# EAGLE design untitled (EAGLE 7.7.0)
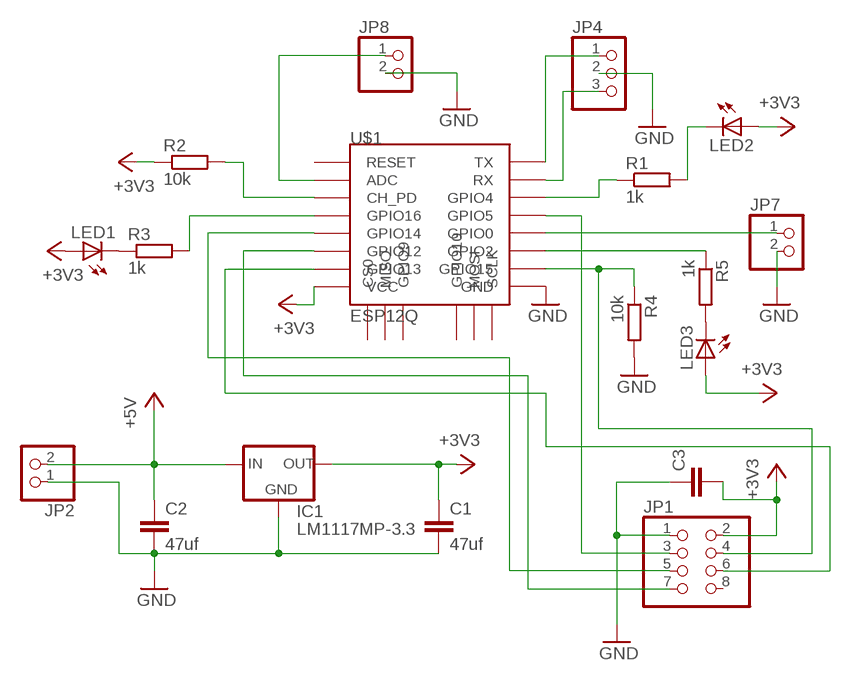
[diagram p0: schematic, sheet 1]

## Parts
C1  47uf  C-EUC1812K  [C1812K]
C2  47uf  C-EUC1812K  [C1812K]
C3  C-EUC3216  [C3216]
IC1  LM1117MP-3.3  [SOT223]
JP1  PINHD-2X4  [2X04]
JP2  PINHD-1X2  [1X02]
JP4  PINHD-1X3  [1X03]
JP7  PINHD-1X2  [1X02]
JP8  PINHD-1X2  [1X02]
LED1  LEDSFH482  [SFH482]
LED2  LEDSFH482  [SFH482]
LED3  LEDSFH482  [SFH482]
R1  1k  R-EU_R0805  [R0805]
R2  10k  R-EU_0207/12  [0207/12]
R3  1k  R-EU_R0805  [R0805]
R4  10k  R-EU_M0805  [M0805]
R5  1k  R-EU_R0805  [R0805]
U$1  ESP12Q  [ESP12Q]

## Nets
+3V3: C1.1 C3.2 IC1.2(OUT) IC1.4(OUT) JP1.2 LED1.A LED2.A LED3.A R2.1 U$1.VCC
+5V: C2.1 IC1.3(IN) JP2.2
GND: C1.2 C2.2 C3.1 IC1.1(GND) JP1.1 JP2.1 JP4.2 JP7.2 JP8.2 R4.2 U$1.GND
N$1: JP1.3 U$1.GPIO5
N$2: JP1.4 R4.1 U$1.GPIO15
N$3: JP7.1 U$1.GPIO0
N$4: R3.2 U$1.GPIO16
N$5: JP1.5 U$1.GPIO14
N$6: JP1.7 U$1.GPIO12
N$7: R2.2 U$1.CH_PD
N$8: LED1.K(C) R3.1
N$10: JP1.6 U$1.GPIO13
N$11: R5.1 U$1.GPIO2
N$12: LED3.K(C) R5.2
N$13: LED2.K(C) R1.2
N$15: JP4.3 U$1.RX
N$16: JP4.1 U$1.TX
N$17: JP8.1 U$1.ADC
N$25: R1.1 U$1.GPIO4
Unconnected: JP1.8 U$1.CS0 U$1.GPIO9 U$1.GPIO10 U$1.MISO U$1.MOSI U$1.RESET U$1.SCLK

## Library data of the parts
C1-C3 = rcl:C-EU: CAPACITOR, European symbol
IC1 = lm1117_11:LM1117?-*: 800mA Low-Dropout Linear Regulator Source: http://www.ti.com/lit/ds/symlink/lm1117-n.pdf; MF: Texas Instruments; MPN: LM1117MP-3.3; OC_FARNELL: 9778195; OC_NEWARK: 28X3416
JP1 = pinhead:PINHD-2X4: PIN HEADER
JP2 JP7 JP8 = pinhead:PINHD-1X2: PIN HEADER
JP4 = pinhead:PINHD-1X3: PIN HEADER
LED1-LED3 = led:LED: LED OSRAM: - CHIPLED LG R971, LG N971, LY N971, LG Q971, LY Q971, LO R971, LY R971 LH N974, LH R974 LS Q976, LO Q976, LY Q976 LO Q996 - Hyper CHIPLED LW Q18S LB Q993, LB Q99A, LB R99A - SideLED LS A670, LO A670, LY A670, LG A670, LP A670 LB A673, LV A673, LT A673, LW A673 LH A674 LY A675 LS A676, LA A676, LO A676, LY A676, LW A676 LS A679, LY A679, LG A679 - Hyper Micro SIDELED® LS Y876, LA Y876, LO Y876, LY Y876 LT Y87S - SmartLED LW L88C, LW L88S LB L89C, LB L89S, LG L890 LS L89K, LO L89K, LY L89K LS L896, LA L896, LO L896, LY L896 - TOPLED LS T670, LO T670, LY T670, LG T670, LP T670 LSG T670, LSP T670, LSY T670, LOP T670, LYG T670 LG T671, LOG T671, LSG T671 LB T673, LV T673, LT T673, LW T673 LH T674 LS T676, LA T676, LO T676, LY T676, LB T676, LH T676, LSB T676, LW T676 LB T67C, LV T67C, LT T67C, LS T67K, LO T67K, LY T67K, LW E67C LS E67B, LA E67B, LO E67B, LY E67B, LB E67C, LV E67C, LT E67C LW T67C LS T679, LY T679, LG T679 LS T770, LO T770, LY T770, LG T770, LP T770 LB T773, LV T773, LT T773, LW T773 LH T774 LS E675, LA E675, LY E675, LS T675 LS T776, LA T776, LO T776, LY T776, LB T776 LHGB T686 LT T68C, LB T68C - Hyper Mini TOPLED® LB M676 - Mini TOPLED Santana® LG M470 LS M47K, LO M47K, LY M47K Source: http://www.osram.convergy.de LUXEON: - LUMILED® LXK2-PW12-R00, LXK2-PW12-S00, LXK2-PW14-U00, LXK2-PW14-V00 LXK2-PM12-R00, LXK2-PM12-S00, LXK2-PM14-U00 LXK2-PE12-Q00, LXK2-PE12-R00, LXK2-PE12-S00, LXK2-PE14-T00, LXK2-PE14-U00 LXK2-PB12-K00, LXK2-PB12-L00, LXK2-PB12-M00, LXK2-PB14-N00, LXK2-PB14-P00, LXK2-PB14-Q00 LXK2-PR12-L00, LXK2-PR12-M00, LXK2-PR14-Q00, LXK2-PR14-R00 LXK2-PD12-Q00, LXK2-PD12-R00, LXK2-PD12-S00 LXK2-PH12-R00, LXK2-PH12-S00 LXK2-PL12-P00, LXK2-PL12-Q00, LXK2-PL12-R00 Source: www.luxeon.com KINGBRIGHT: KA-3528ASYC Source: www.kingbright.com
R1-R5 = rcl:R-EU_: RESISTOR, European symbol
U$1 = esp826612q:ESP12Q: ESP8266 Wifi module 12-Q

## Board
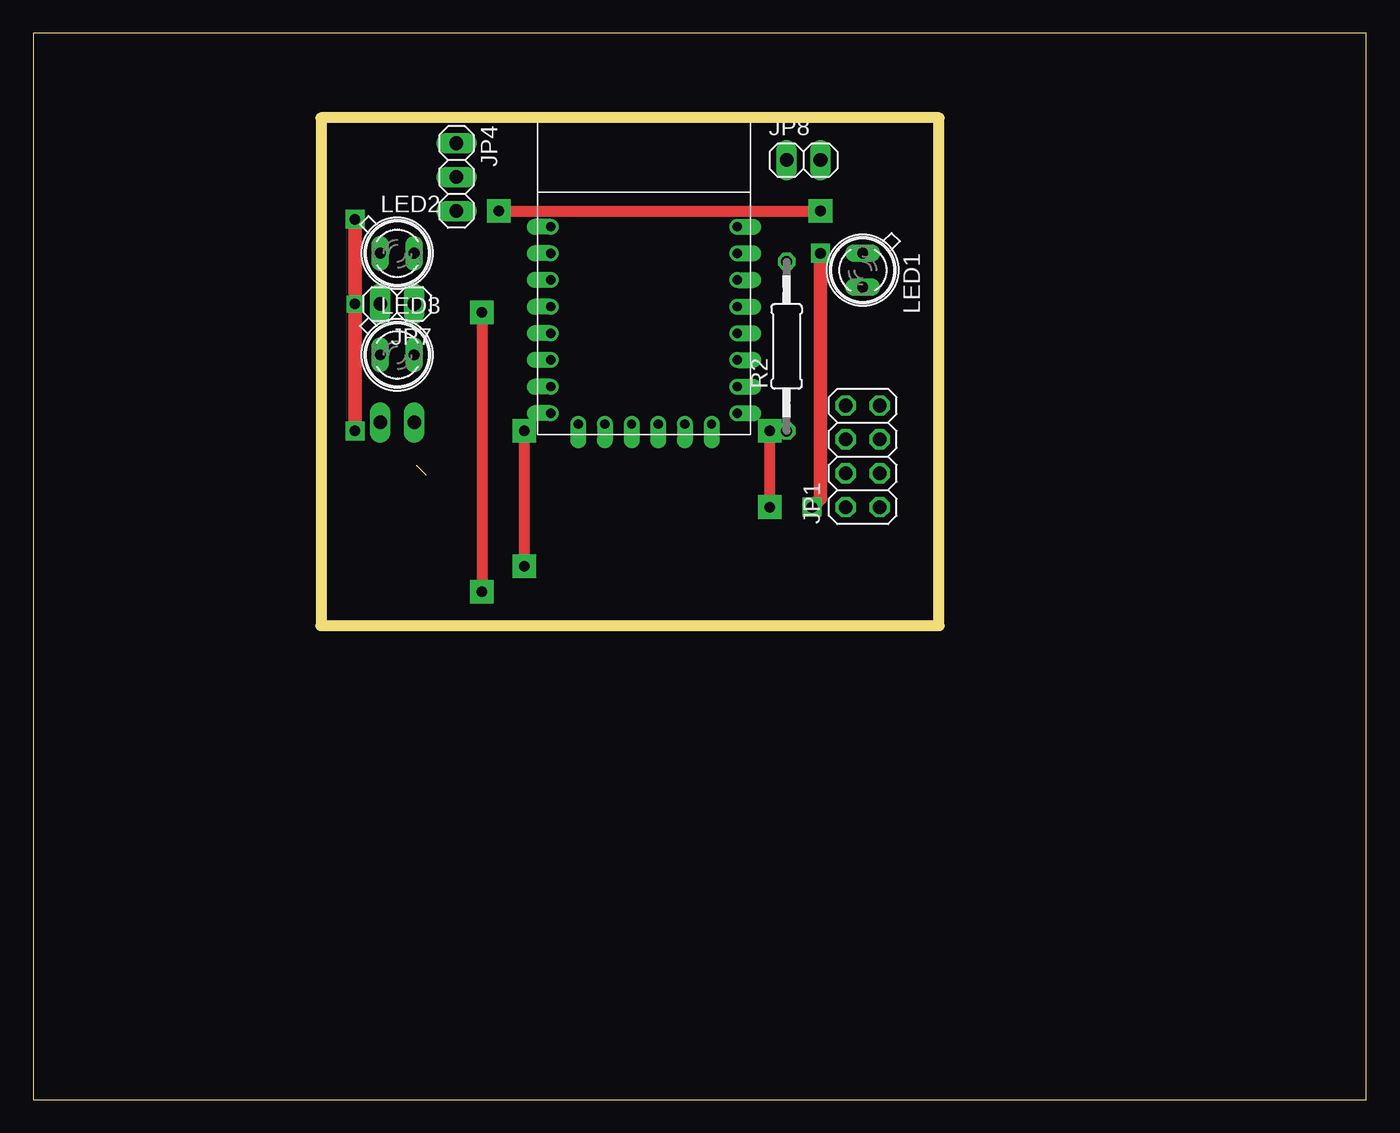
[diagram p1: board, top side]
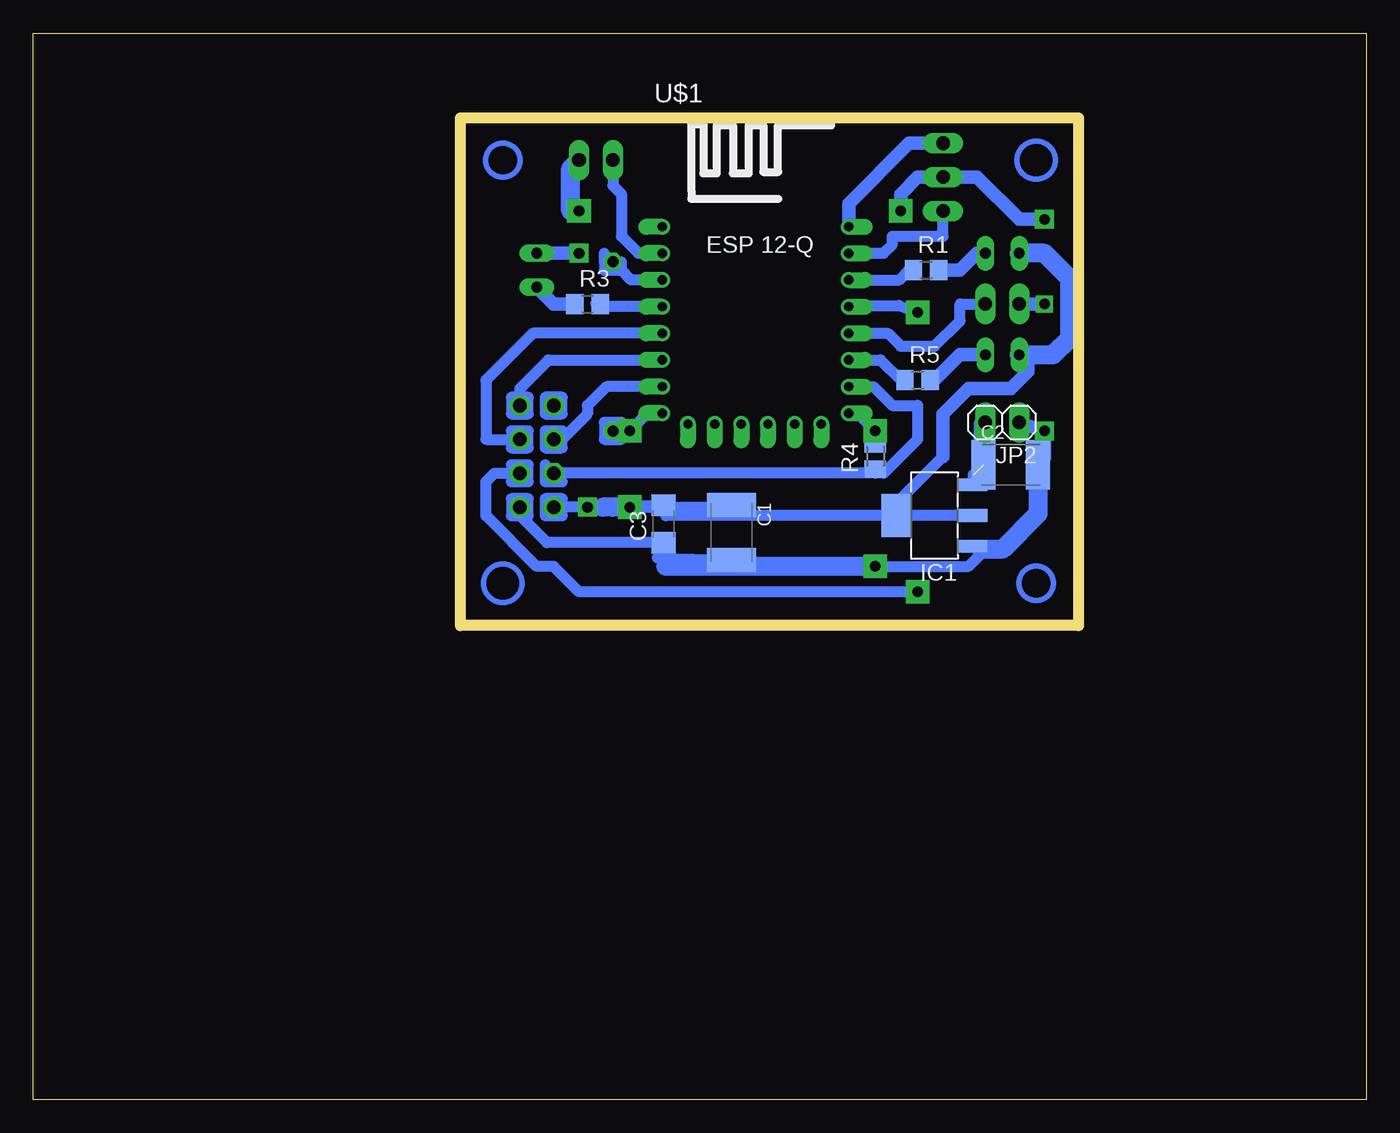
[diagram p2: board, bottom side, seen from below]

Size 100 x 80 mm. Coordinates in mm from the lower left corner, seen from the top.
Outline: 0,0 100,0 100,80 0,80 0,0
Outline: 21.59,73.66 21.59,35.56 67.94,35.56 67.94,73.66 21.59,73.66
Copper layers (1*16): Top 0.035mm / dielectric 1.5mm / Bottom 0.035mm
Design rules "default": minimum track width 10mil, minimum drill 24mil, track to track 8mil, track to pad 8mil, pad to pad 8mil, via to via 8mil, smd to smd 8mil, copper to edge 40mil, drill to drill 8mil, minimum pad ring 10mil, minimum via ring 8mil, stop-mask expansion 4mil, vias tented up to drill 0mil, thermal gap 10mil

### Footprints (pad centres in the part's own frame; a part is rotated, then mirrored left to right if it is on the bottom)
C1812K = smd 1.8 x 3.7: 1 -2.05,0; 2 2.05,0
C3216 = smd 1.6 x 1.8: 1 -1.4,0; 2 1.4,0
SOT223 = smd 0.95 x 2.15: 1 -2.3,-2.9; 2 0,-2.9; 3 2.3,-2.9 | smd 3.25 x 2.15: 4 0,2.9
2X04 = drill 1.016 octagon: 1 -3.81,-1.27; 2 -3.81,1.27; 3 -1.27,-1.27; 4 -1.27,1.27; 5 1.27,-1.27; 6 1.27,1.27; 7 3.81,-1.27; 8 3.81,1.27
1X02 = drill 1.016 long: 1 -1.27,0; 2 1.27,0
1X03 = drill 1.016 long: 1 -2.54,0; 2 0,0; 3 2.54,0
SFH482 = drill 0.813 long: A -1.27,0; K 1.27,0
R0805 = smd 1.3 x 1.5: 1 -0.95,0; 2 0.95,0
0207/12 = drill 0.813 octagon: 1 -6.35,0; 2 6.35,0
M0805 = smd 1.3 x 1.6: 1 -0.95,0; 2 0.95,0
ESP12Q = drill 0.7 offset: ADC -7.1,3.8; CH_PD -7.1,1.8; CS0 -5.165,-9.005; GND 6.9,-8.2; GPIO0 6.9,-2.2; GPIO2 6.9,-4.2; GPIO4 6.9,1.8; GPIO5 6.9,-0.2; GPIO9 -1.165,-9.005; GPIO10 0.835,-9.005; GPIO12 -7.1,-4.2; GPIO13 -7.1,-6.2; GPIO14 -7.1,-2.2; GPIO15 6.9,-6.2; GPIO16 -7.1,-0.2; MISO -3.165,-9.005; MOSI 2.835,-9.005; RESET -7.1,5.8; RX 6.9,3.8; SCLK 4.835,-9.005; TX 6.9,5.8; VCC -7.1,-8.2

### Placement (x,y rotation side)
C1  47.62,42.55 270 bottom
C2  26.67,47.62 0 bottom
C3  52.7,43.18 90 bottom
IC1  32.38,43.81 90 bottom
JP1  62.23,48.26 90 top
JP2  27.3,50.8 180 bottom
JP4  31.75,69.22 270 top
JP7  27.3,59.69 180 top
JP8  57.78,70.48 0 top
LED1  62.23,62.23 270 top
LED2  27.3,63.5 0 top
LED3  27.3,55.88 0 top
R1  33.02,62.23 0 bottom
R2  56.52,56.52 90 top
R3  58.42,59.69 0 bottom
R4  36.83,48.26 90 bottom
R5  33.66,53.98 0 bottom
U$1  45.72,59.69 0 bottom

### Tracks (layer width: path | path; a pad name or v marks a point on that pad's centre or on a via)
+3V3  (via drill 0.8 pad 1.42, 0.8 pad 1.78)
  Top 0.813: v55.24,50.16 v55.24,44.45
  Top 1.016: v59.05,63.5 59.05,45.09 v58.42,44.45
  Bottom 0.813: 31.75,48.26 34.92,45.09 34.92,44.17 IC1.4 | IC1.2 IC1.4 | IC1.4 52.56,43.81 C1.1 48.41,44.45 v55.24,44.45 | 52.88,51.44 U$1.VCC 53.92,51.49 v55.24,50.16 R2.1 | 57.28,44.45 C3.2 57.78,44.45 v58.42,44.45 JP1.2
  Bottom 1.016: 31.75,48.26 31.75,51.44 29.84,53.34 26.67,53.34 25.4,54.61 25.4,55.24 LED3.A | LED1.A v59.05,63.5 | v58.42,44.45 56.52,44.45
  Bottom 1.422: v55.24,44.45 56.52,44.45 57.28,44.45 | LED3.A 23.5,55.88 22.23,57.15 22.23,61.59 24.13,63.5 LED2.A
+5V  (1 unrouted)
  Bottom 0.813: IC1.3 29.48,46.86
  Bottom 1.422: C2.1 28.72,50.66 JP2.2
GND  (via drill 0.8 pad 1.27, 0.8 pad 1.42, 0.8 pad 1.78)
  Top 0.813: v36.83,50.16 v36.83,40.01 | v34.92,66.67 v59.05,66.67
  Top 1.016: v24.13,66.04 v24.13,59.69 v24.13,50.16
  Bottom 0.406: R4.2 v36.83,50.16
  Bottom 0.813: 24.77,47.77 C2.2 | IC1.1 29.25,41.27 28.57,41.27 29.84,40.01 v36.83,40.01 | U$1.GND 38.16,51.49 v36.83,50.16 | 52.56,40.01 C1.2 53.2,40.64 50.8,40.01 | C3.1 61.47,41.78 63.5,43.81 JP1.1 | v59.05,66.67 59.69,66.67
  Bottom 1.016: v34.92,66.67 34.92,67.94 33.66,69.22 JP4.2 29.21,69.22 26.04,66.04 v24.13,66.04 | JP7.2 v24.13,59.69 | JP2.1 v24.13,50.16 24.13,48.12 C2.2
  Bottom 1.422: C2.2 24.62,43.96 27.3,41.27 28.57,41.27 | v36.83,40.01 50.8,40.01 | 50.8,40.01 52.56,40.01 | C3.1 52.58,40.51 50.8,40.01 | 59.69,66.67 59.69,69.85 JP8.2
N$1  (via drill 0.8 pad 1.78)
  Top 0.813: v33.66,59.05 v33.66,38.1
  Bottom 0.813: v33.66,59.05 35.03,59.59 38.73,59.59 U$1.GPIO5 | v33.66,38.1 59.05,38.1 60.96,40.01 62.23,40.01 66.04,43.81 66.04,46.35 65.41,46.99 JP1.3
N$2
  Bottom 0.406: R4.1 36.83,46.99
  Bottom 0.813: U$1.GPIO15 36.98,53.49 35.56,52.07 33.66,52.07 33.66,49.53 36.2,46.99 36.83,46.99 JP1.4 | JP1.4 61.59,47.62 61.59,46.35 60.33,46.35 JP1.4
N$3
  Bottom 0.813: U$1.GPIO0 35.9,57.49 34.92,56.52 32.38,56.52 30.48,58.42 30.48,59.69 JP7.1
N$4
  Bottom 0.813: U$1.GPIO16 57.59,59.49 57.78,59.69 R3.2
N$5
  Bottom 0.813: U$1.GPIO14 62.52,57.49 66.04,53.98 66.04,49.53 JP1.5
N$6
  Bottom 0.813: JP1.7 63.5,53.34 61.35,55.49 U$1.GPIO12
N$7
  Bottom 0.813: U$1.CH_PD 55.14,61.49 55.88,62.23 | 55.88,62.23 R2.2 57.15,62.87 | 57.15,62.87 57.15,62.23 55.88,62.23 | 55.88,62.23 55.88,62.87 | 57.15,62.87 57.15,63.5
N$8
  Bottom 1.016: R3.1 60.96,59.69 LED1.K
N$9
  Bottom 0.813: 55.88,50.8 57.15,50.8 57.15,49.53 55.88,49.53
N$10
  Bottom 0.813: U$1.GPIO13 57,53.49 58.42,52.07 58.42,51.44 60.33,49.53 JP1.6
N$11
  Bottom 0.813: U$1.GPIO2 36.44,55.49 34.92,53.98 R5.1
N$12
  Bottom 1.016: R5.2 32.38,53.98 30.48,55.88 LED3.K
N$13
  Bottom 1.016: R1.2 30.48,62.23 29.21,63.5 LED2.K
N$15
  Bottom 0.813: U$1.RX 36.2,63.49 35.56,64.14 35.56,64.77 31.75,64.77 JP4.3
N$16
  Bottom 1.016: U$1.TX 38.82,67.22 34.29,71.75 JP4.1
N$17
  Bottom 0.813: JP8.1 56.52,68.58 55.88,67.94 55.88,64.77 54.61,63.5 U$1.ADC
N$18
  Bottom 0.813: 60.33,52.7 61.59,52.7 61.59,51.44 60.33,51.44 60.33,52.7
N$19
  Bottom 0.813: 62.87,52.7 64.14,52.7 64.14,51.44 62.87,51.44 62.87,52.7
N$20
  Bottom 0.813: 60.33,50.16 61.59,50.16 61.59,48.9 60.33,48.9 60.33,50.16
N$21
  Bottom 0.813: 62.87,50.16 64.14,50.16 64.14,48.9 62.87,48.9 62.87,50.16
N$22
  Bottom 0.813: 62.87,47.62 64.14,47.62 64.14,46.35 62.87,46.35 62.87,47.62
N$23
  Bottom 0.813: 60.33,45.09 61.59,45.09 61.59,43.81 60.33,43.81 60.33,45.09
N$24
  Bottom 0.813: 62.87,45.09 64.14,45.09 64.14,43.81 62.87,43.81 62.87,45.09
N$25
  Bottom 0.813: U$1.GPIO4 35.03,61.49 34.29,62.23 R1.1
(copper drawn outside any net)
  shapes: Bottom circle x4